# EAGLE schematic Ublox_board (EAGLE 9.2.2)
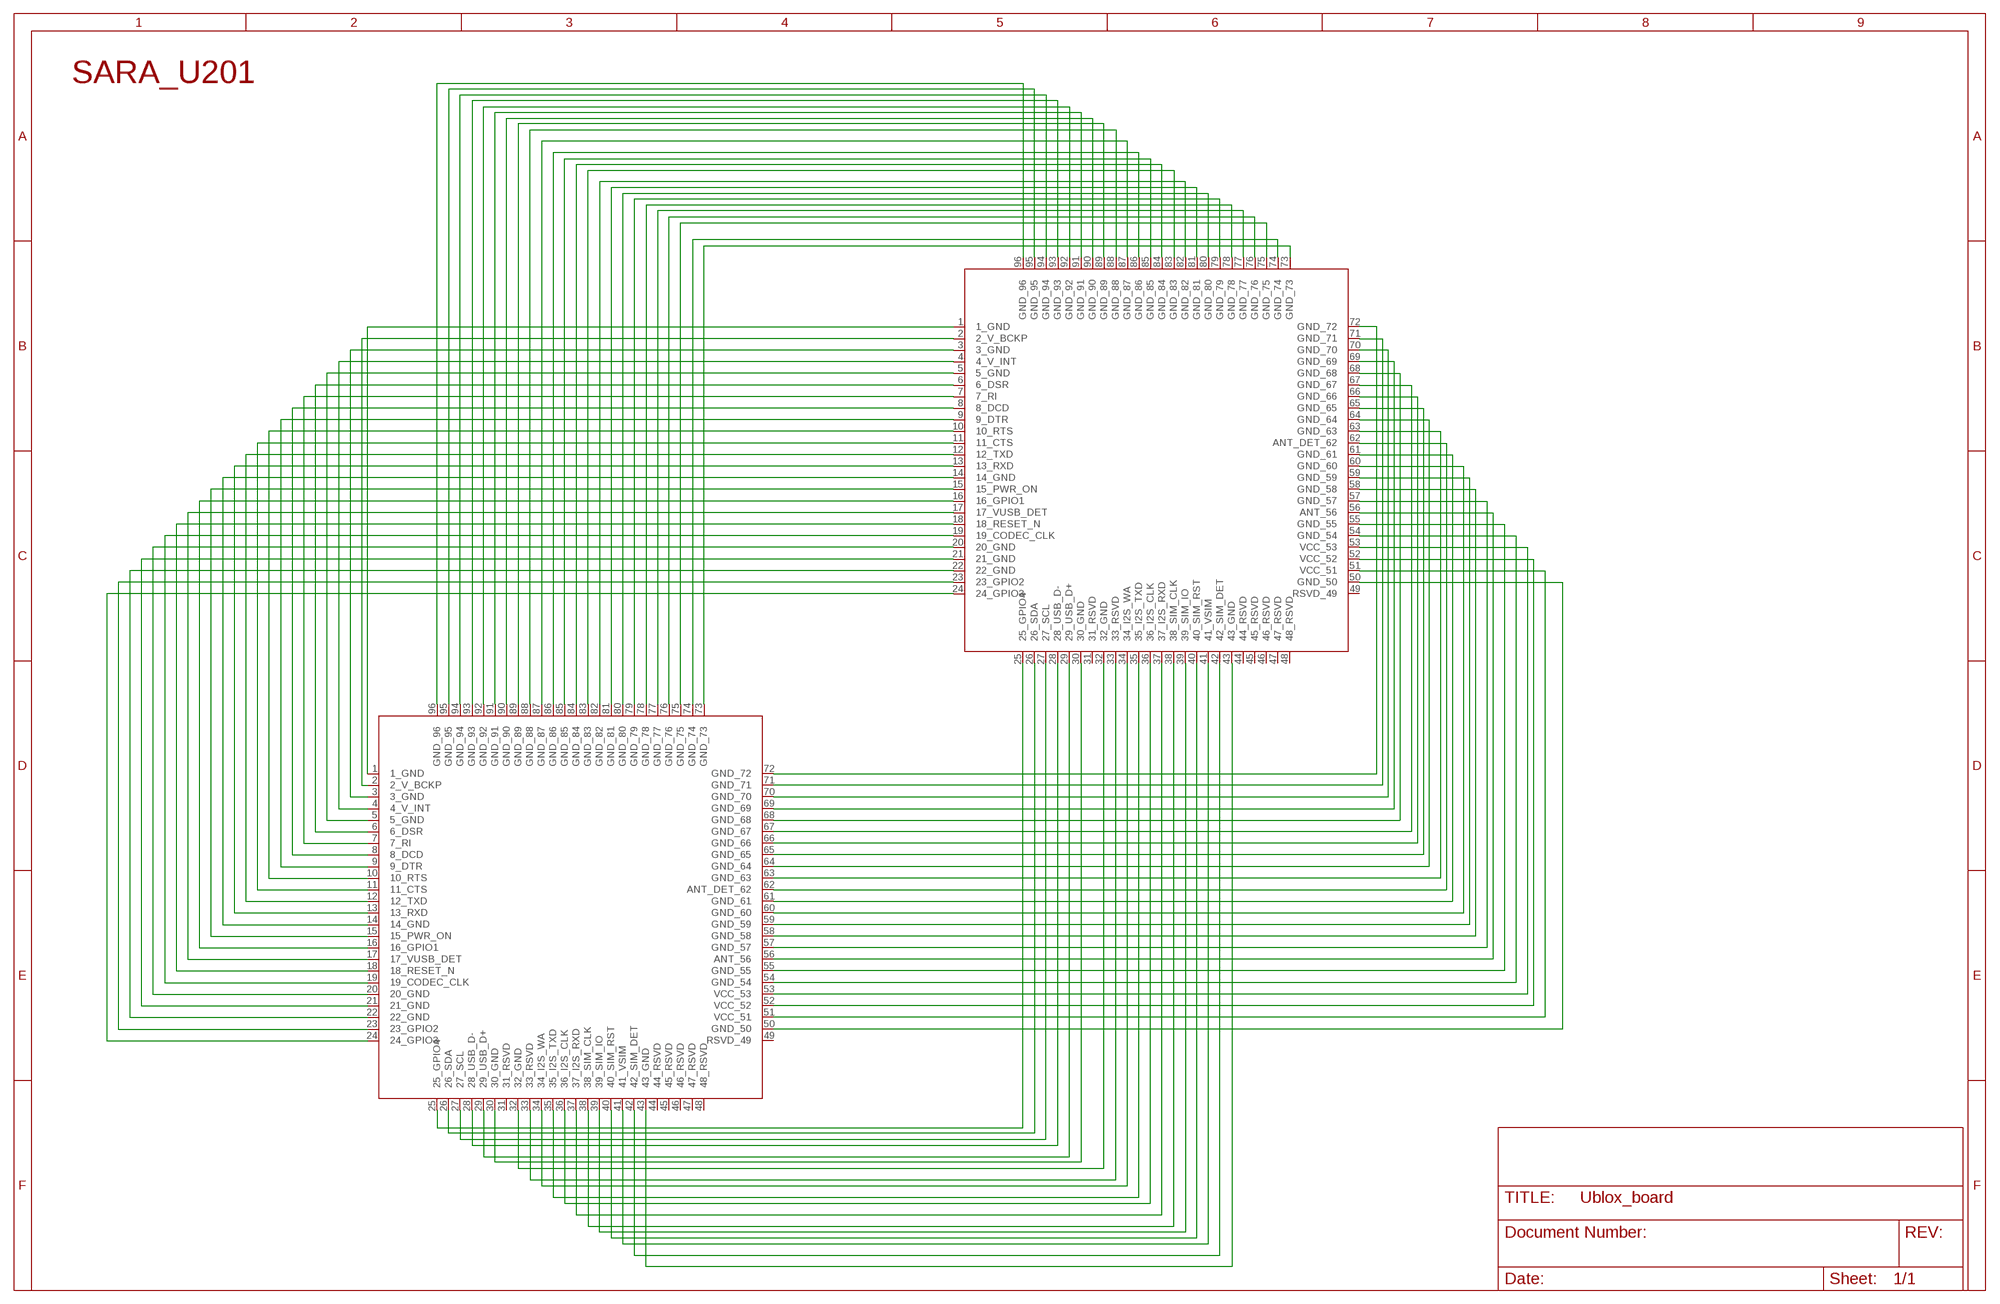
[diagram p0: schematic, sheet 1]

## Parts
U$1  SARA_U201  [SARA_U201]
U$2  SARA_U201  [SARA_U201]

## Nets
N$1: U$1.72(GND_72) U$2.72(GND_72)
N$2: U$1.71(GND_71) U$2.71(GND_71)
N$3: U$1.70(GND_70) U$2.70(GND_70)
N$4: U$1.69(GND_69) U$2.69(GND_69)
N$5: U$1.68(GND_68) U$2.68(GND_68)
N$6: U$1.67(GND_67) U$2.67(GND_67)
N$7: U$1.66(GND_66) U$2.66(GND_66)
N$8: U$1.65(GND_65) U$2.65(GND_65)
N$9: U$1.64(GND_64) U$2.64(GND_64)
N$10: U$1.63(GND_63) U$2.63(GND_63)
N$11: U$1.62(ANT_DET_62) U$2.62(ANT_DET_62)
N$12: U$1.61(GND_61) U$2.61(GND_61)
N$13: U$1.60(GND_60) U$2.60(GND_60)
N$14: U$1.59(GND_59) U$2.59(GND_59)
N$15: U$1.58(GND_58) U$2.58(GND_58)
N$16: U$1.57(GND_57) U$2.57(GND_57)
N$17: U$1.56(ANT_56) U$2.56(ANT_56)
N$18: U$1.55(GND_55) U$2.55(GND_55)
N$19: U$1.54(GND_54) U$2.54(GND_54)
N$20: U$1.53(VCC_53) U$2.53(VCC_53)
N$21: U$1.52(VCC_52) U$2.52(VCC_52)
N$22: U$1.51(VCC_51) U$2.51(VCC_51)
N$23: U$1.50(GND_50) U$2.50(GND_50)
N$24: U$1.25(25_GPIO4) U$2.25(25_GPIO4)
N$25: U$1.26(26_SDA) U$2.26(26_SDA)
N$26: U$1.27(27_SCL) U$2.27(27_SCL)
N$27: U$1.28(28_USB_D-) U$2.28(28_USB_D-)
N$28: U$1.29(29_USB_D+) U$2.29(29_USB_D+)
N$29: U$1.30(30_GND) U$2.30(30_GND)
N$30: U$1.32(32_GND) U$2.32(32_GND)
N$31: U$1.33(33_RSVD) U$2.33(33_RSVD)
N$32: U$1.34(34_I2S_WA) U$2.34(34_I2S_WA)
N$33: U$1.35(35_I2S_TXD) U$2.35(35_I2S_TXD)
N$34: U$1.36(36_I2S_CLK) U$2.36(36_I2S_CLK)
N$35: U$1.37(37_I2S_RXD) U$2.37(37_I2S_RXD)
N$36: U$1.38(38_SIM_CLK) U$2.38(38_SIM_CLK)
N$37: U$1.39(39_SIM_IO) U$2.39(39_SIM_IO)
N$38: U$1.40(40_SIM_RST) U$2.40(40_SIM_RST)
N$39: U$1.41(41_VSIM) U$2.41(41_VSIM)
N$40: U$1.42(42_SIM_DET) U$2.42(42_SIM_DET)
N$41: U$1.43(43_GND) U$2.43(43_GND)
N$42: U$1.73(GND_73) U$2.73(GND_73)
N$43: U$1.74(GND_74) U$2.74(GND_74)
N$44: U$1.75(GND_75) U$2.75(GND_75)
N$45: U$1.76(GND_76) U$2.76(GND_76)
N$46: U$1.81(GND_81) U$2.81(GND_81)
N$47: U$1.77(GND_77) U$2.77(GND_77)
N$48: U$1.78(GND_78) U$2.78(GND_78)
N$49: U$1.79(GND_79) U$2.79(GND_79)
N$50: U$1.80(GND_80) U$2.80(GND_80)
N$51: U$1.82(GND_82) U$2.82(GND_82)
N$52: U$1.83(GND_83) U$2.83(GND_83)
N$53: U$1.84(GND_84) U$2.84(GND_84)
N$54: U$1.85(GND_85) U$2.85(GND_85)
N$55: U$1.86(GND_86) U$2.86(GND_86)
N$56: U$1.87(GND_87) U$2.87(GND_87)
N$57: U$1.88(GND_88) U$2.88(GND_88)
N$58: U$1.89(GND_89) U$2.89(GND_89)
N$59: U$1.90(GND_90) U$2.90(GND_90)
N$60: U$1.91(GND_91) U$2.91(GND_91)
N$61: U$1.92(GND_92) U$2.92(GND_92)
N$62: U$1.93(GND_93) U$2.93(GND_93)
N$63: U$1.94(GND_94) U$2.94(GND_94)
N$64: U$1.95(GND_95) U$2.95(GND_95)
N$65: U$1.96(GND_96) U$2.96(GND_96)
N$66: U$1.1(1_GND) U$2.1(1_GND)
N$67: U$1.2(2_V_BCKP) U$2.2(2_V_BCKP)
N$68: U$1.3(3_GND) U$2.3(3_GND)
N$69: U$1.4(4_V_INT) U$2.4(4_V_INT)
N$70: U$1.5(5_GND) U$2.5(5_GND)
N$71: U$1.6(6_DSR) U$2.6(6_DSR)
N$72: U$1.7(7_RI) U$2.7(7_RI)
N$73: U$1.8(8_DCD) U$2.8(8_DCD)
N$74: U$1.9(9_DTR) U$2.9(9_DTR)
N$75: U$1.10(10_RTS) U$2.10(10_RTS)
N$76: U$1.11(11_CTS) U$2.11(11_CTS)
N$77: U$1.12(12_TXD) U$2.12(12_TXD)
N$78: U$1.13(13_RXD) U$2.13(13_RXD)
N$79: U$1.14(14_GND) U$2.14(14_GND)
N$80: U$1.15(15_PWR_ON) U$2.15(15_PWR_ON)
N$81: U$1.16(16_GPIO1) U$2.16(16_GPIO1)
N$82: U$1.17(17_VUSB_DET) U$2.17(17_VUSB_DET)
N$83: U$1.18(18_RESET_N) U$2.18(18_RESET_N)
N$84: U$1.19(19_CODEC_CLK) U$2.19(19_CODEC_CLK)
N$85: U$1.20(20_GND) U$2.20(20_GND)
N$86: U$1.21(21_GND) U$2.21(21_GND)
N$87: U$1.22(22_GND) U$2.22(22_GND)
N$88: U$1.23(23_GPIO2) U$2.23(23_GPIO2)
N$89: U$1.24(24_GPIO3) U$2.24(24_GPIO3)
Unconnected: U$1.31(31_RSVD) U$1.44(44_RSVD) U$1.45(45_RSVD) U$1.46(46_RSVD) U$1.47(47_RSVD) U$1.48(48_RSVD) U$1.49(RSVD_49) U$2.31(31_RSVD) U$2.44(44_RSVD) U$2.45(45_RSVD) U$2.46(46_RSVD) U$2.47(47_RSVD) U$2.48(48_RSVD) U$2.49(RSVD_49)

## Notes on the sheet
- SARA_U201

## Library data of the parts
U$1 U$2 = SARA_U201:SARA_U201

## Net classes
0 default: width 0.19 mm, drill 0.19 mm